# Altium schematic sheet Small_CS_Top.SchDoc
size A4
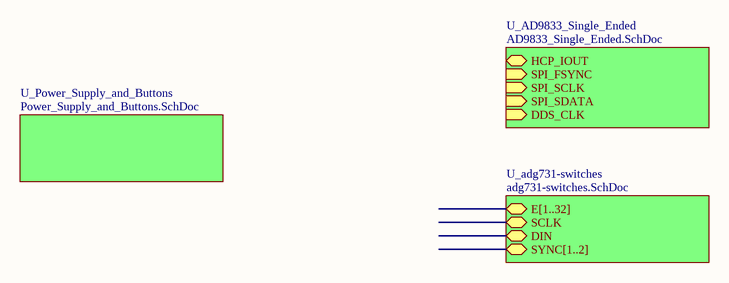
[diagram p0: Small_CS_Top.SchDoc]

## Sub-sheets
U_AD9833_Single_Ended = AD9833_Single_Ended.SchDoc: HCP_IOUT (bidir), SPI_FSYNC (in), SPI_SCLK (in), SPI_SDATA (in), DDS_CLK (in)
U_adg731-switches = adg731-switches.SchDoc: E[1..32] (bidir), SCLK (bidir), DIN (bidir), SYNC[1..2] (bidir)
U_Power_Supply_and_Buttons = Power_Supply_and_Buttons.SchDoc: no entries